# EAGLE design RocketWatch-BOTTOM (EAGLE 9.6.1)
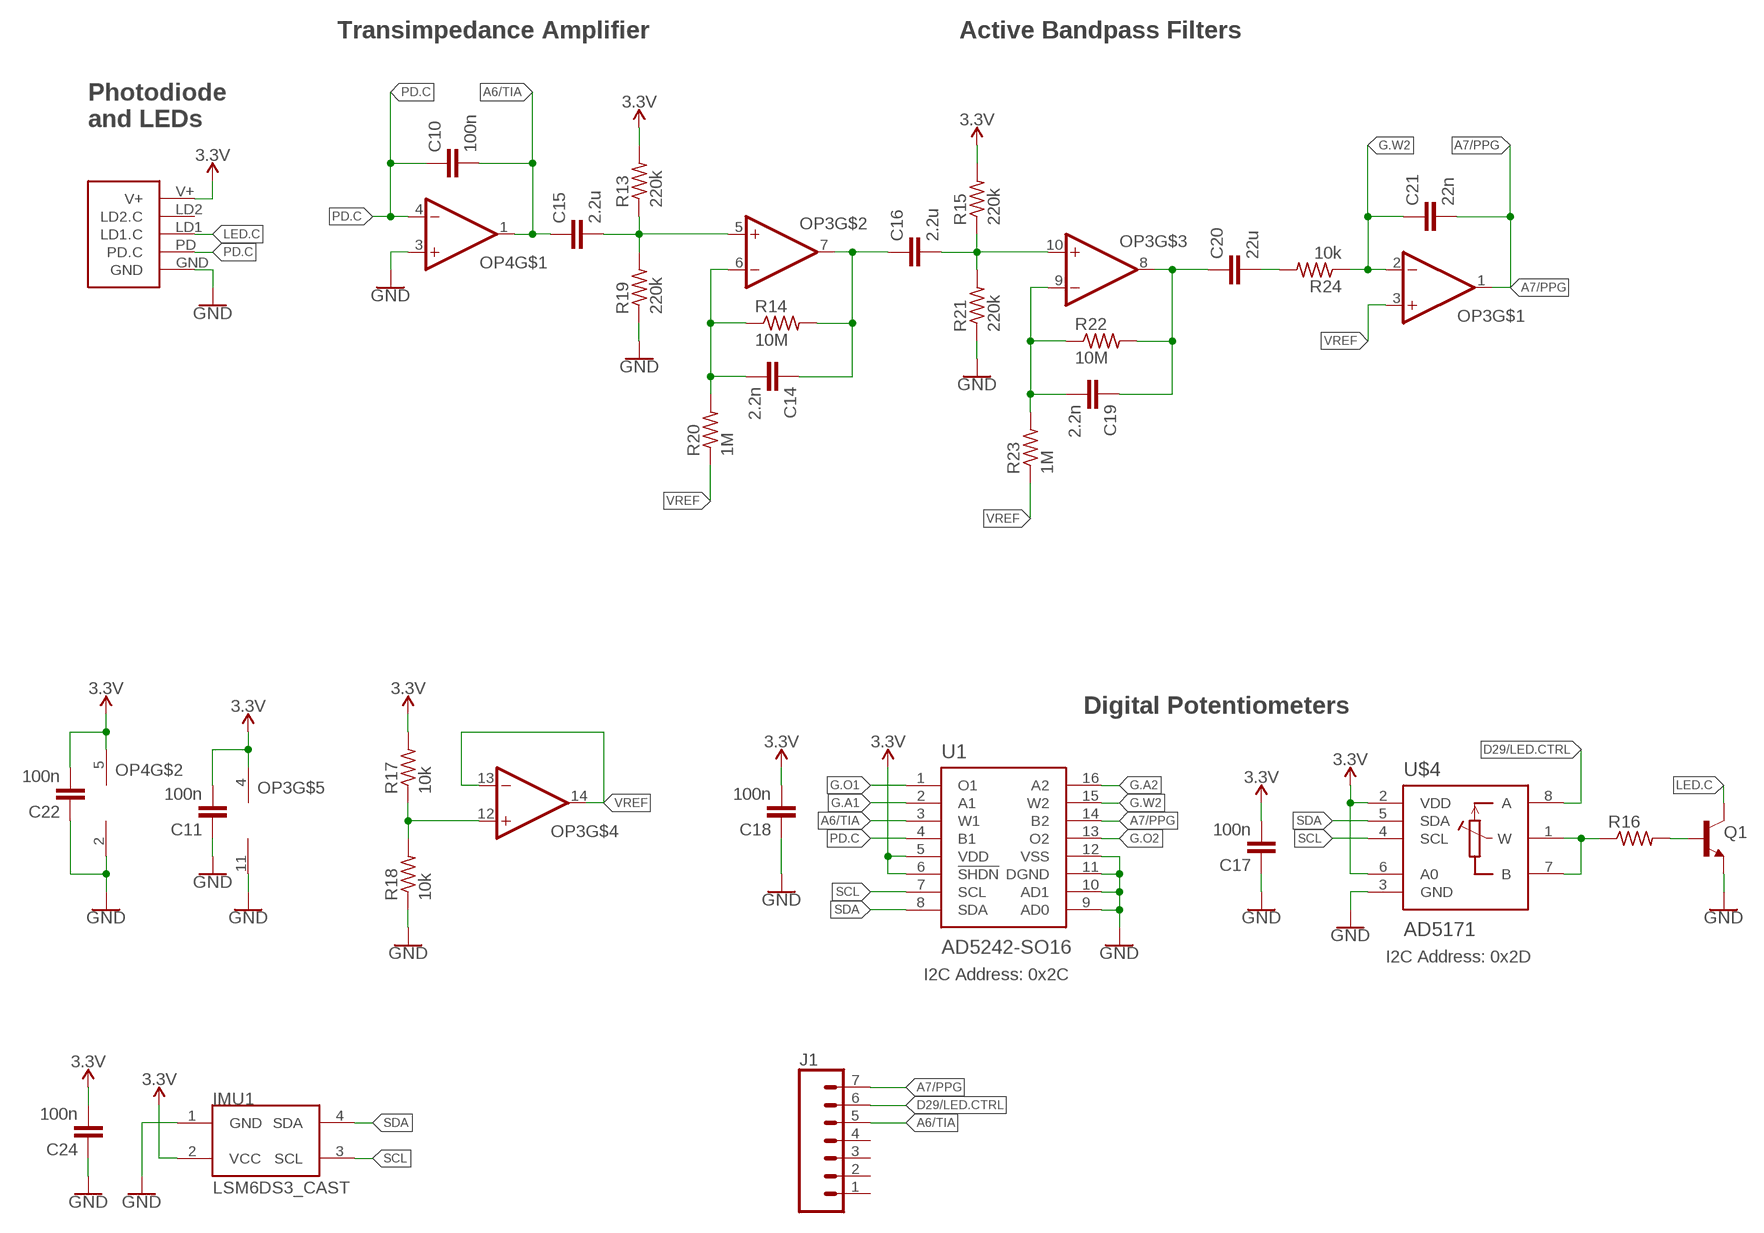
[diagram p0: schematic, sheet 1]

## Parts
C10  100n  CAPACITOR0603  [C0603]
C11  100n  CAPACITOR0603  [C0603]
C14  2.2n  CAPACITOR0603  [C0603]
C15  2.2u  CAPACITOR0603  [C0603]
C16  2.2u  CAPACITOR0603  [C0603]
C17  100n  CAPACITOR0603  [C0603]
C18  100n  CAPACITOR0603  [C0603]
C19  2.2n  CAPACITOR0603  [C0603]
C20  22u  CAPACITOR0603  [C0603]
C21  22n  CAPACITOR0603  [C0603]
C22  100n  CAPACITOR0603  [C0603]
C24  100n  CAPACITOR0603  [C0603]
IMU1  LSM6DS3_CAST  [LSM6DS3_CAST]
J1  CONN_07  [1X07]
OP3  OP-QUAD-SO14  [SO14]
OP4  OP-SINGLEOT  [SOT23-5]
Q1  NPN-GENERIC  [SOT23-3]
R13  220k  RESISTOR0603  [R0603]
R14  10M  RESISTOR0603  [R0603]
R15  220k  RESISTOR0603  [R0603]
R16  RESISTOR0603  [R0603]
R17  10k  RESISTOR0402  [R0402]
R18  10k  RESISTOR0402  [R0402]
R19  220k  RESISTOR0603  [R0603]
R20  1M  RESISTOR0603  [R0603]
R21  220k  RESISTOR0603  [R0603]
R22  10M  RESISTOR0603  [R0603]
R23  1M  RESISTOR0603  [R0603]
R24  10k  RESISTOR0603  [R0603]
U1  AD5242-SO16  [SO16]
U$3  PPG.MODULE.2  [PPG.MODULE.2]
U$4  AD5171  [SOT-23-8]

## Nets
3.3V: C11.2 C17.2 C18.2 C22.2 C24.2 IMU1.2(VCC) OP3.4(V+) OP4.5(V+) R13.2 R15.2 R17.2 U1.5(VDD) U1.6(!SHDN) U$3.V+ U$4.2(VDD) U$4.6(A0)
A6/TIA: C10.2 C15.1 J1.5 OP4.1(OUT) U1.3(W1)
A7/PPG: C21.2 J1.7 OP3.1(OUT) U1.14(B2)
D29/LED.CTRL: J1.6 U$4.8(A)
G.A1: U1.2(A1)
G.A2: U1.16(A2)
G.O1: U1.1(O1)
G.O2: U1.13(O2)
G.W2: C21.1 OP3.2(-IN) R24.1 U1.15(W2)
GND: C11.1 C17.1 C18.1 C22.1 C24.1 IMU1.1(GND) OP3.11(V-) OP4.2(V-) OP4.3(+IN) Q1.2(E) R18.1 R19.1 R21.1 U1.9(AD0) U1.10(AD1) U1.11(DGND) U1.12(VSS) U$3.GND U$4.3(GND)
LED.C: Q1.3(C) U$3.LD1(LD1.C)
N$8: Q1.1(B) R16.2
N$9: R16.1 U$4.1(W) U$4.7(B)
N$10: OP3.12(+IN) R17.1 R18.2
N$13: C15.2 OP3.5(+IN) R13.1 R19.2
N$15: C14.2 OP3.6(-IN) R14.1 R20.2
N$16: C14.1 C16.1 OP3.7(OUT) R14.2
N$17: C16.2 OP3.10(+IN) R15.1 R21.2
N$18: C19.2 OP3.9(-IN) R22.1 R23.2
N$19: C19.1 C20.1 OP3.8(OUT) R22.2
N$20: C20.2 R24.2
PD.C: C10.1 OP4.4(-IN) U1.4(B1) U$3.PD(PD.C)
SCL: IMU1.3(SCL) U1.7(SCL) U$4.4(SCL)
SDA: IMU1.4(SDA) U1.8(SDA) U$4.5(SDA)
VREF: OP3.3(+IN) OP3.13(-IN) OP3.14(OUT) R20.1 R23.1
Unconnected: J1.1 J1.2 J1.3 J1.4 U$3.LD2(LD2.C)

## Notes on the sheet
- Transimpedance Amplifier | Active Bandpass Filters
- Photodiode
  and LEDs
- Digital Potentiometers
- I2C Address: 0x2D
- I2C Address: 0x2C

## Library data of the parts
C10 C11 C14-C22 C24 = LinnesLab-Passives:CAPACITOR
IMU1 = LinnesLab-Sensors:LSM6DS3_CAST
J1 = LinnesLab-Connectors:CONN_07: Multi connection point. Often used as Generic Header-pin footprint for 0.1 inch spaced/style header connections On any of the 0.1 inch spaced packages, you can populate with these: Break Away Headers - Straight <https://www.sparkfun.com/products/116> (PRT-00116) Break Away Male Headers - Right Angle <https://www.sparkfun.com/products/553> (PRT-00553) Female Headers <https://www.sparkfun.com/products/115> (PRT-00115) Break Away Headers - Machine Pin <https://www.sparkfun.com/products/117> (PRT-00117) Break Away Female Headers - Swiss Machine Pin <https://www.sparkfun.com/products/743> (PRT-00743) For SCREWTERMINALS and SPRING TERMINALS visit here: Screw Terimnals on SparkFun.com <https://www.sparkfun.com/search/results?term=Screw+Terminals> (5mm/3.5mm/2.54mm spacing) This device is also useful as a general connection point to wire up your design to another part of your project. Our various solder wires solder well into these plated through hole pads. Hook-Up Wire - Assortment (Stranded, 22 AWG) <https://www.sparkfun.com/products/11375> (PRT-11375) Hook-Up Wire - Assortment (Solid Core, 22 AWG) <https://www.sparkfun.com/products/11367> (PRT-11367) View the entire wire category on our website here <https://www.sparkfun.com/categories/141> Special notes: Molex polarized connector foot print use with SKU : PRT-08231 with associated crimp pins and housings. 1MM SMD Version SKU: PRT-10208 NOTES ON THE VARIANTS LOCK and LOCK_LONGPADS... This footprint was designed to help hold the alignment of a through-hole component (i.e. 6-pin header) while soldering it into place. You may notice that each hole has been shifted either up or down by 0.005 of an inch from it's more standard position (which is a perfectly straight line). This slight alteration caused the pins (the squares in the middle) to touch the edges of the holes. Because they are alternating, it causes a "brace" to hold the component in place. 0.005 has proven to be the perfect amount of "off-center" position when using our standard breakaway headers. Although looks a little odd when you look at the bare footprint, once you have a header in there, the alteration is very hard to notice. Also,if you push a header all the way into place, it is covered up entirely on the bottom side.
OP3 = LinnesLab-AnalogIC:OP-QUAD: General symbol and footprints for Quad Op Amps. Use with any standard general purpose op amp.
OP4 = LinnesLab-AnalogIC:OP-SINGLE: Single Op Amp 2.7V to 6.0V Single Supply CMOS Source: http://ww1.microchip.com/downloads/en/DeviceDoc/21314g.pdf
Q1 = LinnesLab-DiscreteSemi:NPN
R13-R24 = LinnesLab-Passives:RESISTOR
U1 = LinnesLab-DigitalIC:AD5242
U$3 = LinnesLab-Connectors:PPG.MODULE.2: Digi-Key Part Number: S9014E-50-ND Manufacturer Part Number: GRPB501VWVN-RC Description: 1mm insulation height 0.05in pitch 50 positions
U$4 = LinnesLab-DigitalIC:AD5171

## Board
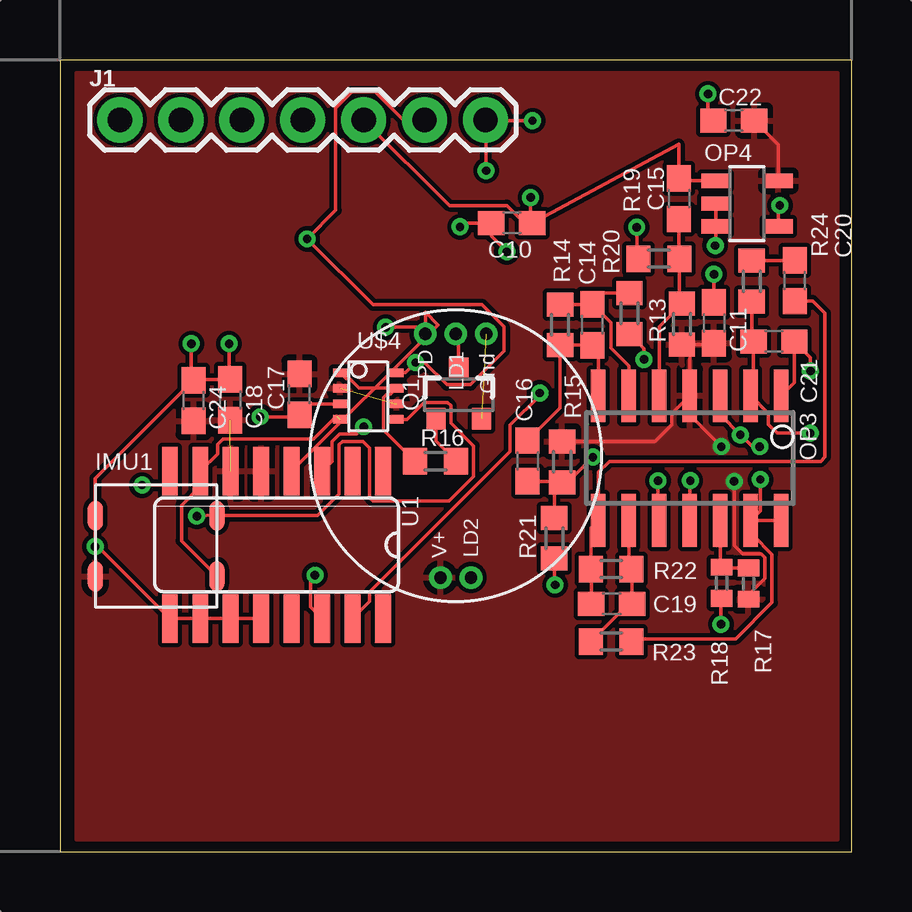
[diagram p1: board, top side]
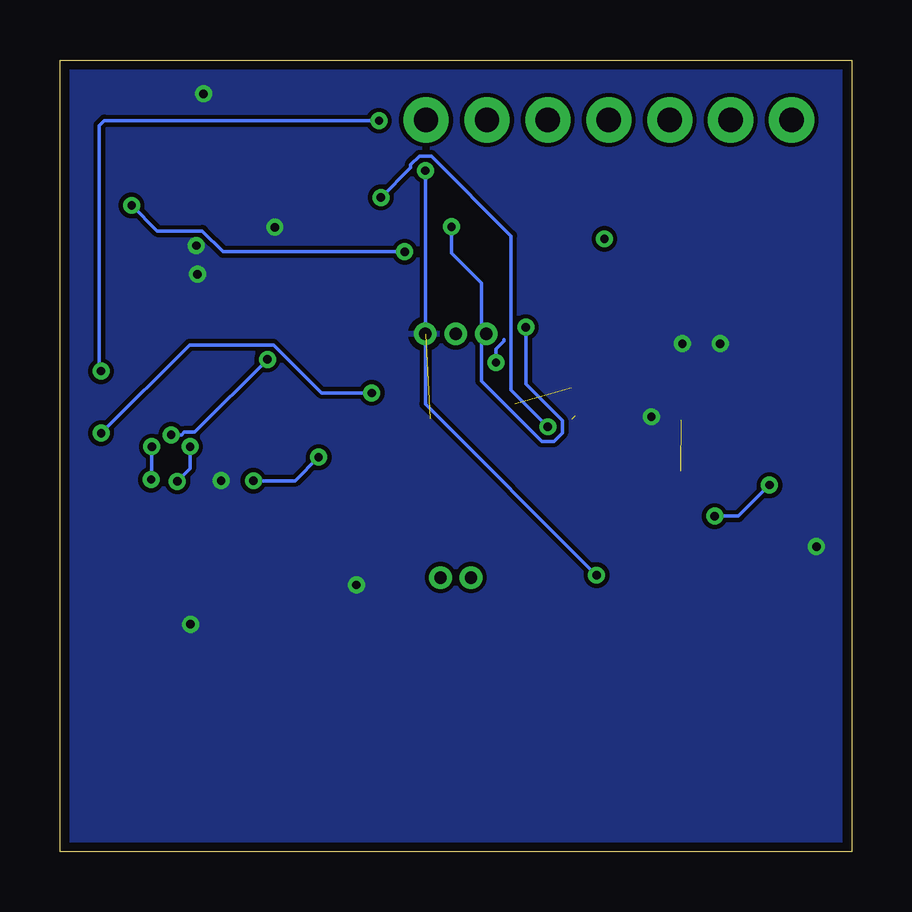
[diagram p2: board, bottom side, seen from below]

Size 33 x 33 mm. Coordinates in mm from the lower left corner, seen from the top.
Outline: 0,0 33,0 33,33 0,33 0,0
Copper layers (1*16): Top 0.0356mm / dielectric 1.5011mm / Bottom 0.0356mm
Design rules "LaenPCBOrder": minimum track width 6mil, minimum drill 13mil, track to track 6mil, track to pad 6mil, pad to pad 6mil, via to via 6mil, smd to smd 6mil, copper to edge 15mil, drill to drill 6mil, minimum pad ring 7mil, minimum via ring 7mil, stop-mask expansion 3mil, vias tented up to drill 0mil, thermal gap 10mil

### Footprints (pad centres in the part's own frame; a part is rotated, then mirrored left to right if it is on the bottom)
C0603 = smd 1.1 x 1: 1 -0.85,0; 2 0.85,0
LSM6DS3_CAST = smd 0.635 x 1.27: 1 -2.54,1.27; 2 -2.54,-1.27; 3 2.54,-1.27; 4 2.54,1.27
1X07 = drill 1.016 pad 1.88: 1 0,0; 2 2.54,0; 3 5.08,0; 4 7.62,0; 5 10.16,0; 6 12.7,0; 7 15.24,0
SO14 = smd 0.6 x 2.2: 1 -3.81,-2.6; 2 -2.54,-2.6; 3 -1.27,-2.6; 4 0,-2.6; 5 1.27,-2.6; 6 2.54,-2.6; 7 3.81,-2.6; 8 3.81,2.6; 9 2.54,2.6; 10 1.27,2.6; 11 0,2.6; 12 -1.27,2.6; 13 -2.54,2.6; 14 -3.81,2.6
SOT23-5 = smd 0.6 x 1.2: 1 -0.95,-1.306; 2 0,-1.306; 3 0.95,-1.306; 4 0.95,1.306; 5 -0.95,1.306
SOT23-3 = smd 0.8 x 0.9: 1 -0.95,-1; 2 0.95,-1; 3 0,1.1
R0603 = smd 1 x 1.1: 1 -0.85,0; 2 0.85,0
R0402 = smd 0.7 x 0.9: 1 -0.65,0; 2 0.65,0
SO16 = smd 0.66 x 2.032: 1 -4.445,-3.073; 2 -3.175,-3.073; 3 -1.905,-3.073; 4 -0.635,-3.073; 5 0.635,-3.073; 6 1.905,-3.073; 7 3.175,-3.073; 8 4.445,-3.073; 9 4.445,3.073; 10 3.175,3.073; 11 1.905,3.073; 12 0.635,3.073; 13 -0.635,3.073; 14 -1.905,3.073; 15 -3.175,3.073; 16 -4.445,3.073
PPG.MODULE.2 = drill 0.508 pad 0.94: GND 1.27,5.08; LD1 0,5.08; LD2 0.635,-5.08; PD -1.27,5.08; V+ -0.635,-5.08
SOT-23-8 = smd 0.35 x 0.6: 1 -0.991,-1.176; 2 -0.341,-1.176; 3 0.309,-1.176; 4 0.959,-1.176; 5 0.959,1.176; 6 0.309,1.176; 7 -0.341,1.176; 8 -0.991,1.176

### Placement (x,y rotation side)
C10  18.84,26.2 0 top
C11  27.27,22.04 270 top
C14  22.2,21.96 90 top
C15  25.8,27.21 270 top
C16  19.49,16.29 270 top
C17  9.99,19.06 90 top
C18  7.09,18.83 270 top
C19  23,10.32 0 top
C20  30.64,23.8 90 top
C21  29.76,21.26 0 top
C22  28.09,30.47 0 top
C24  5.57,18.8 270 top
IMU1  4.01,12.73 0 top
J1  2.5,30.5 0 top
OP3  26.26,16.4 180 top
OP4  28.64,27.01 270 top
Q1  16.62,19.04 0 top
R13  25.93,21.99 270 top
R14  20.85,21.96 270 top
R15  20.94,16.25 90 top
R16  15.66,16.27 0 top
R17  28.7,11.17 270 top
R18  27.58,11.2 90 top
R19  24.97,24.72 0 top
R20  23.74,22.43 90 top
R21  20.61,13.06 90 top
R22  22.98,11.78 180 top
R23  22.98,8.75 180 top
R24  28.84,23.78 90 top
U1  9.03,12.78 180 top
U$3  16.5,16.5 0 top
U$4  12.85,18.97 270 top

### Tracks (layer width: path | path; a pad name or v marks a point on that pad's centre or on a via)
3.3V  (via drill 0.35)  (2 unrouted)
  Top 0.152: C11.2 27.22,21.14 R13.2 26.25,20.81 OP3.4 | OP3.4 25.51,18.26 25.51,17.81 24.8,17.09 R15.2 | OP3.4 26.25,18.2 v27.57,16.88 | v28.11,15.43 28.11,12.77 28.48,12.4 29.25,12.4 29.38,12.27 29.38,11.38 28.7,10.7 R17.2 | C22.2 29.95,29.47 OP4.5
  Bottom 0.152: v27.57,16.88 27.57,15.97 v28.11,15.43
  pour Top (isolate 0.178): 0.67,32.48 32.42,32.48 32.42,0.5 0.67,0.5
A6/TIA  (via drill 0.35)
  Top 0.152: OP4.1 25.9,27.96 C15.1 25.8,29.49 C10.2 19.62,26.27 | U1.3 11.34,16.26 11.34,17.09 11.65,17.41 12.36,17.41 v12.66,17.71 | v19.62,27.27 19.62,26.27 | 19.62,26.27 19.3,26.27 18.63,26.93 16.23,26.93 J1.5
  Bottom 0.152: v12.66,17.71 14.19,19.23 14.19,25.66 17.52,28.99 18.02,28.99 18.38,28.64 18.38,28.52 v19.62,27.27
A7/PPG  (via drill 0.35)
  Top 0.152: OP3.1 30.61,19.55 C21.2 31.28,20.59 v31.28,20.03 | U1.14 10.45,10.19 10.45,11.34 v10.63,11.52 | v17.77,28.39 17.77,30.47 | 17.77,30.47 J1.7 | v19.7,30.47 17.77,30.47
  Bottom 0.152: v17.77,28.39 17.77,18.66 v10.63,11.52 | v31.28,20.03 31.36,20.11 31.36,30.26 31.16,30.47 v19.7,30.47
D29/LED.CTRL  (via drill 0.35)
  Top 0.152: J1.6 15.2,30.44 14.37,30.44 13.14,31.67 12.18,31.67 11.49,30.98 11.49,26.73 v10.3,25.54 13.05,22.79 17.6,22.79 18.51,21.89 18.51,20.86 17.12,19.47 16.13,19.47 15.21,20.39 v14.82,20.39 14.4,19.96 U$4.8
  Bottom 0.152: 14.49,21.35 14.49,21.27 14.82,20.95 v14.82,20.39
G.W2  (via drill 0.35)
  Top 0.152: R24.1 28.84,21.33 C21.1 28.91,19.12 OP3.2 29.54,18.26 29.54,17.81 29.91,17.44 v31.28,17.44 | U1.15 12.91,10.42 12.91,10.82 18.77,16.67 18.77,17.78 20,19.02 v20,19.11
  Bottom 0.152: v20,19.11 22.09,19.11 24.1,21.12 27.6,21.12 v31.28,17.44
GND  (via drill 0.35)  (1 unrouted)
  Top 0.152: R18.1 27.56,10.53 v27.56,9.47 | OP3.11 26.25,15.43 v26.28,15.46 | R21.1 20.61,11.15 v20.64,11.11 | C11.1 v27.27,24.07 | R19.1 24.04,24.8 v24.04,26.02 | C22.1 27.02,30.7 v27.02,31.59 | OP4.2 OP4.3 27.33,25.28 v27.32,25.26 | v5.48,21.17 5.48,19.74 C24.1 1.47,15.55 IMU1.1 1.47,12.72 | U1.12 U1.11 U1.10 U1.9 1.57,12.72 1.47,12.72 | v7.05,21.17 7.05,19.72 C18.1 5.9,19.68 | 1.47,12.72 v1.46,12.71 | v8.35,18.12 9.9,18.12 C17.1 10.44,18.66 U$4.3
  pour Bottom (isolate 0.178): 0.55,32.79 32.7,32.79 32.7,32.79 32.7,0.23 29.39,0.23 0.41,0.23 0.41,2.62 0.41,32.78 0.53,32.78 0.53,32.79
LED.C
  Top 0.152: U$3.LD1 16.62,21.46 Q1.3
N$8
  Top 0.152: R16.2 15.67,17.11 Q1.1
N$9
  Top 0.152: R16.1 13.5,17.58 13.5,18.93 13.63,19.07 13.78,19.07 U$4.7 12.47,19.31 12.07,19.72 11.92,19.72 U$4.1
N$10
  Top 0.152: R17.1 27.61,11.82 R18.2 27.52,11.91 OP3.12
N$13
  Top 0.152: C15.2 25.8,24.74 R19.2 25.82,22.94 R13.1 24.98,21.9 OP3.5
N$15
  Top 0.152: R20.2 22.67,23.28 C14.2 | C14.2 R14.1 | C14.2 22.96,22.05 22.96,20.99 23.71,20.23 OP3.6
N$16
  Top 0.152: OP3.7 22.45,20.86 C14.1 R14.2 20.85,18.49 C16.1
N$17  (via drill 0.35)
  Top 0.152: C16.2 20.9,15.44 | 20.9,15.44 R15.1 21.17,15.39 v22.22,16.45 | R21.2 20.61,15.15 20.9,15.44 | v24.93,15.46 24.93,13.86 OP3.10
  Bottom 0.152: v22.22,16.45 23.2,15.46 v24.93,15.46
N$18
  Top 0.152: OP3.9 23.71,11.89 R22.1 23.85,11.75 C19.2 23.7,10.32 R23.2
N$19
  Top 0.152: C20.1 31.38,22.95 31.89,22.44 31.89,16.45 31.71,16.27 22.9,16.27 22.45,15.82 OP3.8 22.13,13.48 R22.2 22.15,11.75 C19.1
N$20
  Top 0.152: C20.2 30.62,24.63 R24.2
PD.C  (via drill 0.35)
  Top 0.152: U1.4 15.76,21.96 15.23,22.49 U$3.PD 14.95,21.86 v13.58,21.86 | v16.68,26.05 16.83,26.2 C10.1 17.99,25.66 v18.63,25.01 | OP4.4 29.95,26.87 v30.01,26.94
  Bottom 0.152: v16.68,26.05 16.68,24.95 15.43,23.71 15.43,19.62 12.91,17.1 12.41,17.1 12.06,17.46 12.06,17.96 13.58,19.48 v13.58,21.86 | v18.63,25.01 26.21,25.01 27.07,25.87 28.94,25.87 v30.01,26.94
SCL  (1 unrouted)
  Top 0.152: IMU1.3 5.06,12.95 5.06,14.43 5.85,15.22 U1.7 6.56,16.57 6.56,16.97 6.8,17.2 10.58,17.2 11.53,18.16
SDA  (via drill 0.35)
  Top 0.152: IMU1.4 6.36,14 | IMU1.4 6.52,14.04 v5.7,13.98 | v3.42,15.28 4.58,15.28 U1.8 | IMU1.4 10.75,14 11.64,14.9 11.64,16.97 11.78,17.1 12.63,17.1 12.91,16.82 12.91,14.75 13.05,14.61 16.23,14.61 17.24,15.63 17.24,16.91 16.3,17.86 16.3,18.59 16.17,18.72 15.18,18.72 14.47,18.01 U$4.5
  Bottom 0.152: v5.7,13.98 4.71,13.98 v3.42,15.28
VREF  (via drill 0.35)
  Top 0.152: OP3.14 OP3.13 28.9,13.91 | R20.1 24.35,20.97 v24.35,20.52 | OP3.3 27.52,18.21 v28.36,17.37 28.86,16.88 v29.17,16.88 | v29.2,15.51 29.2,14.21 28.9,13.91 | 28.9,13.91 28.9,13.18 29.69,12.39 29.69,10.38 28.17,8.87 23.94,8.87 R23.1
  Bottom 0.152: v24.35,20.52 27.38,17.48 27.82,17.48 27.94,17.37 v28.36,17.37 | v29.17,16.88 29.17,15.53 v29.2,15.51